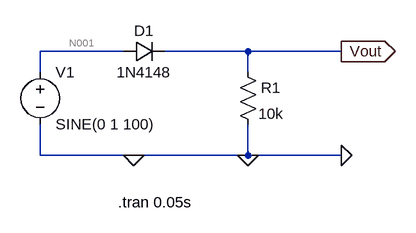
[diagram p0: schematic half wave rectifier .asc]
half wave rectifier .asc, the LTspice schematic file:
Version 4
SHEET 1 880 680
WIRE 272 144 144 144
WIRE 464 144 336 144
WIRE 608 144 464 144
WIRE 144 176 144 144
WIRE 464 176 464 144
WIRE 144 304 144 256
WIRE 288 304 144 304
WIRE 464 304 464 256
WIRE 464 304 288 304
WIRE 608 304 464 304
FLAG 464 304 0
FLAG 288 304 0
FLAG 608 144 Vout
IOPIN 608 144 Out
FLAG 608 304 0
SYMBOL voltage 144 160 R0
SYMATTR InstName V1
SYMATTR Value SINE(0 1 100)
SYMBOL diode 272 160 R270
WINDOW 0 32 32 VTop 2
WINDOW 3 0 32 VBottom 2
SYMATTR InstName D1
SYMATTR Value 1N4148
SYMBOL res 448 160 R0
WINDOW 3 32 80 Left 2
SYMATTR Value 10k
SYMATTR InstName R1
TEXT 264 376 Left 2 !.tran 0.05s

The netlist it stands for:
* half wave rectifier .asc
V1 N001 0 SINE(0 1 100)
D1 N001 Vout 1N4148
R1 Vout 0 10k
.model D D
.lib standard.dio
.tran 0.05s
.backanno
.end

* Results of the author's LTspice run, read from the files saved beside the schematic
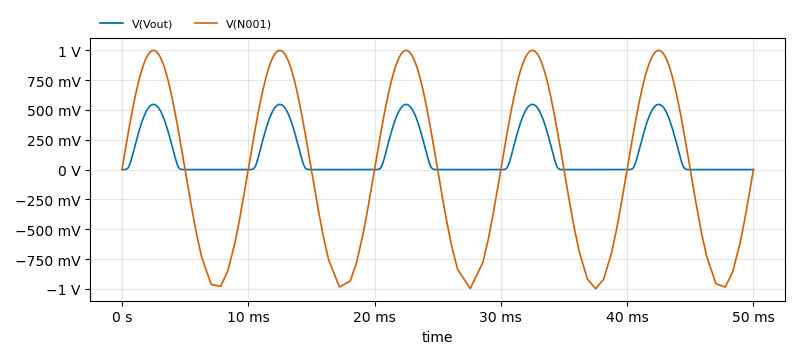
[diagram p1: Transient Analysis of half wave rectifier .asc, plotted from the saved traces]
* Transient Analysis, 1 run:
*   V(Vout): min -48.38 µV, max 547.2 mV, average 135.1 mV, rms 239.9 mV, last 25.16 µV
*   V(N001): min -1 V, max 1 V, average 4.488 mV, rms 703.1 mV, last 0 V